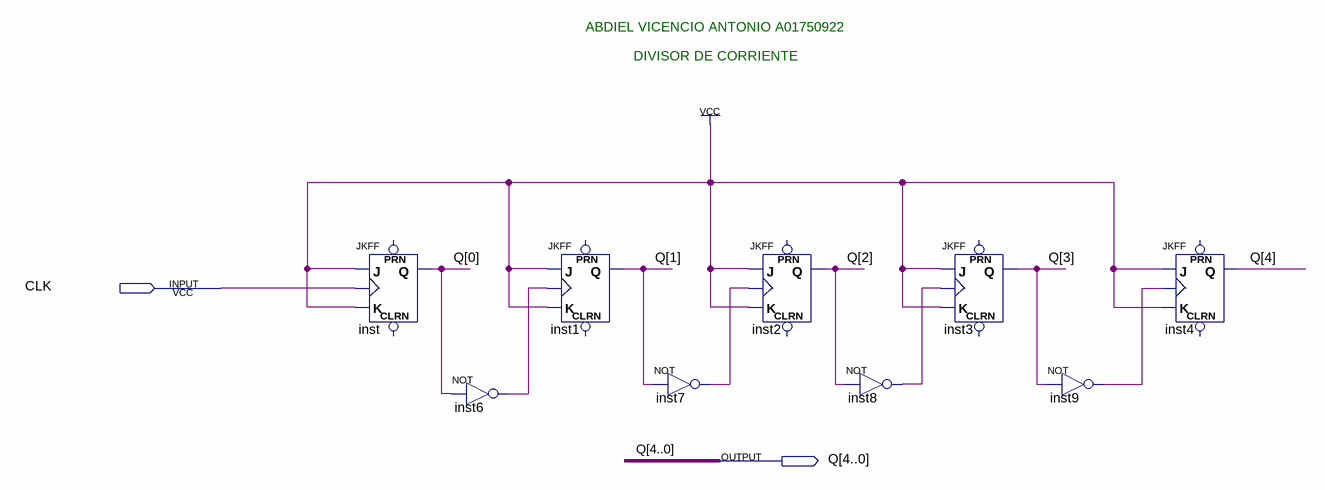
[diagram p0: schematic sheet]
// Quartus schematic DivisorDeCorriente.bdf as structural Verilog: 9 symbols, 2 pins
module DivisorDeCorriente (
  input  CLK,
  output [4:0] Q
);

  wire inst6_out, inst7_out, inst8_out, inst9_out;

  JKFF inst (.K(1'b1), .J(1'b1), .CLK(CLK), .Q(Q[0]));  // open: PRN, CLRN
  not inst6 (inst6_out, Q[0]);
  JKFF inst1 (.K(1'b1), .J(1'b1), .CLK(inst6_out), .Q(Q[1]));  // open: PRN, CLRN
  not inst7 (inst7_out, Q[1]);
  JKFF inst2 (.K(1'b1), .J(1'b1), .CLK(inst7_out), .Q(Q[2]));  // open: PRN, CLRN
  not inst8 (inst8_out, Q[2]);
  JKFF inst3 (.K(1'b1), .J(1'b1), .CLK(inst8_out), .Q(Q[3]));  // open: PRN, CLRN
  not inst9 (inst9_out, Q[3]);
  JKFF inst4 (.K(1'b1), .J(1'b1), .CLK(inst9_out), .Q(Q[4]));  // open: PRN, CLRN

  // Notes on the sheet:
  //   ABDIEL VICENCIO ANTONIO A01750922
  //   DIVISOR DE CORRIENTE
endmodule
